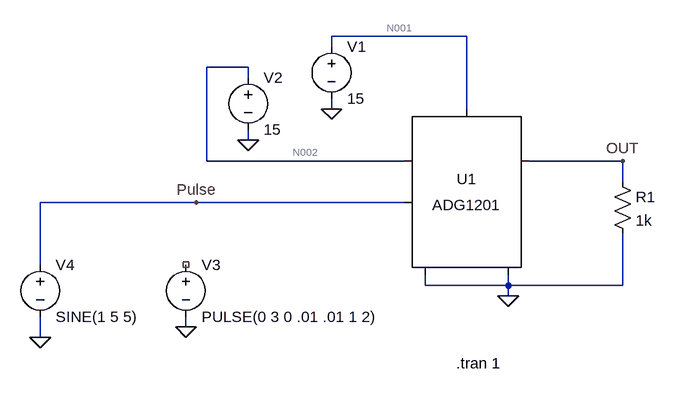
[diagram p0: schematic ADG1201.asc]
ADG1201.asc, the LTspice schematic file:
Version 4
SHEET 1 880 680
WIRE 208 -80 0 -80
WIRE 0 -64 0 -80
WIRE -128 -32 -192 -32
WIRE -128 -16 -128 -32
WIRE 0 32 0 16
WIRE 208 32 208 -80
WIRE -128 80 -128 64
WIRE -192 112 -192 -32
WIRE 112 112 -192 112
WIRE 448 112 304 112
WIRE 448 144 448 112
WIRE -208 176 -448 176
WIRE 112 176 -208 176
WIRE -448 272 -448 176
WIRE 144 304 144 288
WIRE 272 304 272 288
WIRE 272 304 144 304
WIRE 448 304 448 224
WIRE 448 304 272 304
WIRE 272 320 272 304
WIRE -224 368 -224 352
WIRE -448 384 -448 352
FLAG 272 320 0
FLAG 0 32 0
FLAG -128 80 0
FLAG -224 368 0
FLAG 448 112 OUT
FLAG -208 176 Pulse
FLAG -448 384 0
SYMBOL Switches\\ADG1201 208 160 R0
SYMATTR InstName U1
SYMBOL voltage 0 -80 R0
WINDOW 123 0 0 Left 0
WINDOW 39 0 0 Left 0
SYMATTR InstName V1
SYMATTR Value 15
SYMBOL voltage -128 -32 R0
WINDOW 123 0 0 Left 0
WINDOW 39 0 0 Left 0
SYMATTR InstName V2
SYMATTR Value 15
SYMBOL voltage -224 256 R0
WINDOW 123 0 0 Left 0
WINDOW 39 0 0 Left 0
SYMATTR InstName V3
SYMATTR Value PULSE(0 3 0 .01 .01 1 2)
SYMBOL res 432 128 R0
SYMATTR InstName R1
SYMATTR Value 1k
SYMBOL voltage -448 256 R0
WINDOW 123 0 0 Left 0
WINDOW 39 0 0 Left 0
SYMATTR InstName V4
SYMATTR Value SINE(1 5 5)
TEXT 192 424 Left 2 !.tran 1

The netlist it stands for:
* ADG1201.asc
XU1 Pulse OUT N002 0 0 N001 ADG1201
V1 N001 0 15
V2 N002 0 15
V3 NC_01 0 PULSE(0 3 0 .01 .01 1 2)
R1 OUT 0 1k
V4 Pulse 0 SINE(1 5 5)
.tran 1
.lib ADG1201.sub
.backanno
.end

* Results of the author's LTspice run, read from the files saved beside the schematic
* Operating Point, zero values left out:
*   V(n001) = 15 V
*   V(n002) = 15 V
*   V(out) = 15.06 µV
*   V(pulse) = 1 V
*   I(R1) = 15.06 nA
*   I(V2) = -15.06 nA
*   I(V1) = -45.03 nA
*   Ix(u1:2) = -15.03 nA
*   Ix(u1:3) = 15.03 nA
*   Ix(u1:4) = -45.03 nA
*   Ix(u1:6) = 45.03 nA